# Altium schematic sheet ANT.SchDoc: Title
size A4; Date: *******; ApprovedBy: *******; CheckedBy: None; Author: *******; CompanyName: *******; DrawnBy: Name; Engineer: *******; Organization: *******; Address1: *******; Address2: *******; Address3: *******; Address4: *******; DocumentNumber: 5; Revision: *******; SheetNumber: 3; SheetTotal: 9; CurrentTime: *******; CurrentDate: *******; Time: *******; DocumentFullPathAndName: *******; DocumentName: *******; ModifiedDate: *******; ImagePath: *******; ProjectName: *******; Application_BuildNumber: *******
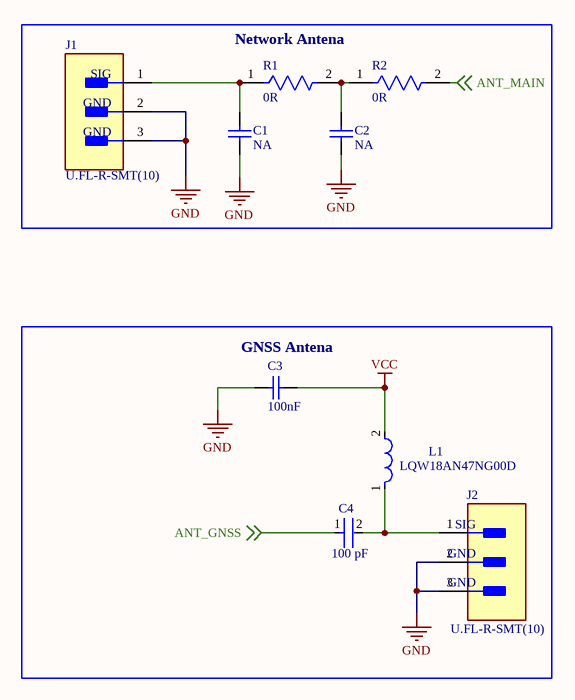
[diagram p0: ANT.SchDoc]

## Parts
C1  NA  [CAPC2013X145X50ML20T25]
C2  NA  [CAPC2013X145X50ML20T25]
C3  Capacitance: 100nF  [CAPC2013X135X45ML10T25]  (hidden comment: GRM21BR71H104KA01L)
C4  Capacitance: 100 pF  [FP-C0805C-DN-MFG]  (hidden comment: C0805C101J1GACTU)
J1  U.FL-R-SMT(10)  [FP-U_FL-R-SMT_10-MFG]
J2  U.FL-R-SMT(10)  [FP-U_FL-R-SMT_10-MFG]
L1  LQW18AN47NG00D  [FP-LQW18AN_00-MFG]
R1  0R  [FP-CRCW0805-e3-IPC_B]
R2  0R  [FP-CRCW0805-e3-IPC_B]

## Blocks framed on the sheet
Network Antena: C1 C2 J1 R1 R2
GNSS Antena: C3 C4 J2 L1

## Nets
GND: C1.1 C2.1 C3.1 J1.2(GND) J1.3(GND) J2.2(GND) J2.3(GND)
VCC: C3.2 L1.2
ANT_GNSS: C4.1 ; off-sheet ANT_GNSS
ANT_MAIN: R2.2 ; off-sheet ANT_MAIN
NetC1_2: C1.2 J1.1(SIG) R1.1
NetC2_2: C2.2 R1.2 R2.1
NetC4_2: C4.2 J2.1(SIG) L1.1

## Notes on the sheet
- Title:
- Page Contents:
- 410, Ridham Plaza
- Thingslista Automation LLp
- Size:
- Date:
- File:
- Drawn By:
- A4
- Last_Modify
- Time:
- Checked By:
- Revision:
- Sheet
- of
- Gujarat, 382450
- Near Amar Javan Circle
- Nikol, Ahmedabad

## Library data of the parts
C1 C2 = CMP-1036-04819-2: Part Number: C0805C225K9PACTU; Manufacturer: Kemet
C3 = CMP-2100-03644-1: Chip Capacitor, 0.1 uF, +/- 10%, 50 V, -55 to 125 degC, 0805 (2012 Metric), RoHS, Tape and Reel; Manufacturer: Murata; Voltage: 50V; Insulation Resistance: 10GR; Dielectric Material: Ceramic; Dielectric: X7R; Package Description: 2-Pin Surface Mount Device, Body 2 x 1.25 mm; Manufacturer URL: http://www.murata.com/; Case Code (Imperial): 0805; Datasheet URL: http://psearch.en.murata.com/capacitor/product/GRM21BR71H104KA01%23.pdf; Termination: SMD/SMT; Lead Free: LeadFree; Package Quantity: 1; Mount: SurfaceMount; REACH SVHC: Unknown; Thickness: 0.053inch; Height: 1.25mm; Case/Package: 0805; Voltage Rating: 50V; Width: 0.049inch; Case Code (Metric): 2012; Material: Ceramic; Min Operating Temperature: -55degC; RoHSCompliant: true; Datasheet Version: 42675.0; Voltage Rating (DC): 50V; Tolerance: 10%; Package Reference: 0805; Depth: 1.25mm; Length: 2mm; Max Operating Temperature: 125degC; Packaging: TapeandReel; Number of Pins: 2; Radiation Hardening: No
C4 = CMP-03020-014281-1: CAP CER 100PF 100V C0G/NP0 0805; Manufacturer: KEMET; Temperature Coefficient: 30ppm/°C; Temperature Characteristic: C0G; Material: Ceramic; Tolerance: 0.05; RoHS: TRUE; ComponentLink2URL: https://content.kemet.com/datasheets/KEM_C1003_C0G_SMD.pdf; Voltage Rating: 100 V; Height: 0.88mm; Device Class L3: Ceramic Capacitors; Temperature: -55°C to +125°C; Manufacturer Part Number: C0805C101J1GACTU; Digikey Description: CAP CER 100PF 100V C0G/NP0 0805; Device Class L1: Passive Components; Lead Free: Yes; Package: C0805C-DN; Octopart: https://octopart.com/c0805c101j1gactu-kemet-123666; Automotive: No; Category: Cap; Temperature Range High: +125°C; Mouser Description: Multilayer Ceramic Capacitors MLCC - SMD/SMT 100volts 100pF C0G 5%; Temperature Range Low: -55°C; ComponentLink2Description: Datasheet; Ipc Land Pattern Name: CAPC200125X78; Device Class L2: Capacitors; Value: 100 pF
J1 J2 = CMP-0029-00003-2: CONN U.FL RCPT STR 50 OHM SMD; Plating: Silver; Connector Type: Coaxial; Frequency: 6GHz; Impedance: 50R; Body Material: Bronze; Dielectric Material: Polymer; Contact Plating: Gold; Termination: Solder; Orientation: Vertical; Contact Material: Brass; Min Operating Temperature: -40°C; Mount: Surface Mount; Lead Free: Lead Free; Max Operating Temperature: 90°C; Radiation Hardening: No; Packaging: Tape and Reel; Body Plating: Silver; Fastening Type: Snap; Max Frequency: 6GHz; Depth: 3.1mm; Package Quantity: 1; Case/Package: SMD/SMT; Housing Color: Beige; Length: 3mm
L1 = CMP-06042-007966-1: Wire Wound RF Inductor 47nH ±2% 380mA 0.29Ω 0603 (1608); Self Resonant Frequency: 2.6GHz; DC Resistance (DCR): 290mR; Test Frequency: 100MHz; Q Factor: 38; Shielding: Unshielded; Current: 340mA; Core Material: Non-Magnetic; Weight: 0.000106oz; Depth: 1mm; Resistor Type: Wirewound; Max Operating Temperature: 125°C; Inductance: 47nH; Mount: Surface Mount; DC Current: 380mA; Tolerance: 2%; Height - Seated (Max): 0.039inch; Height: 0.8mm; Radiation Hardening: No; Package Quantity: 4000; Case/Package: 0603; Military Standard: Not; Series Resistance: 290mR; Termination: SMD/SMT; Max DC Current: 380mA; Packaging: Tape and Reel; Min Operating Temperature: -55°C; Case Code (Metric): 1608; REACH SVHC: No SVHC; Lead Free: Lead Free; Inductance Tolerance: 2%; Case Code (Imperial): 0603; Length: 1.6mm; Width: 0.8mm; Number of Pins: 2; Current Rating: 380mA
R1 R2 = CMP-2001-04897-2: RES Thick Film, 0Ω, 0.125W, 0805; Power Rating: 125mW; Resistance: 0mR; Voltage Rating: 150V; Length: 2mm; Width: 0.049inch; Weight: 0.000194oz; Composition: Thick Film; Contact Plating: Tin; Max Power Dissipation: 125mW; Min Operating Temperature: -55°C; Packaging: Tape and Reel; Number of Terminations: 2; Package Quantity: 10000; Case Code (Imperial): 0805; Military Standard: Not; Height: 0.02inch; Features: Automotive AEC-Q200; Depth: 1.25mm; Radiation Hardening: No; Lead Free: Lead Free; Case Code (Metric): 2012; Case/Package: 0805; Voltage Rating (DC): 150V; Termination: SMD/SMT; Max Operating Temperature: 155°C